# Altium schematic sheet 110_ESP32s3.SchDoc
size A4; SheetNumber: 12; SheetTotal: 12
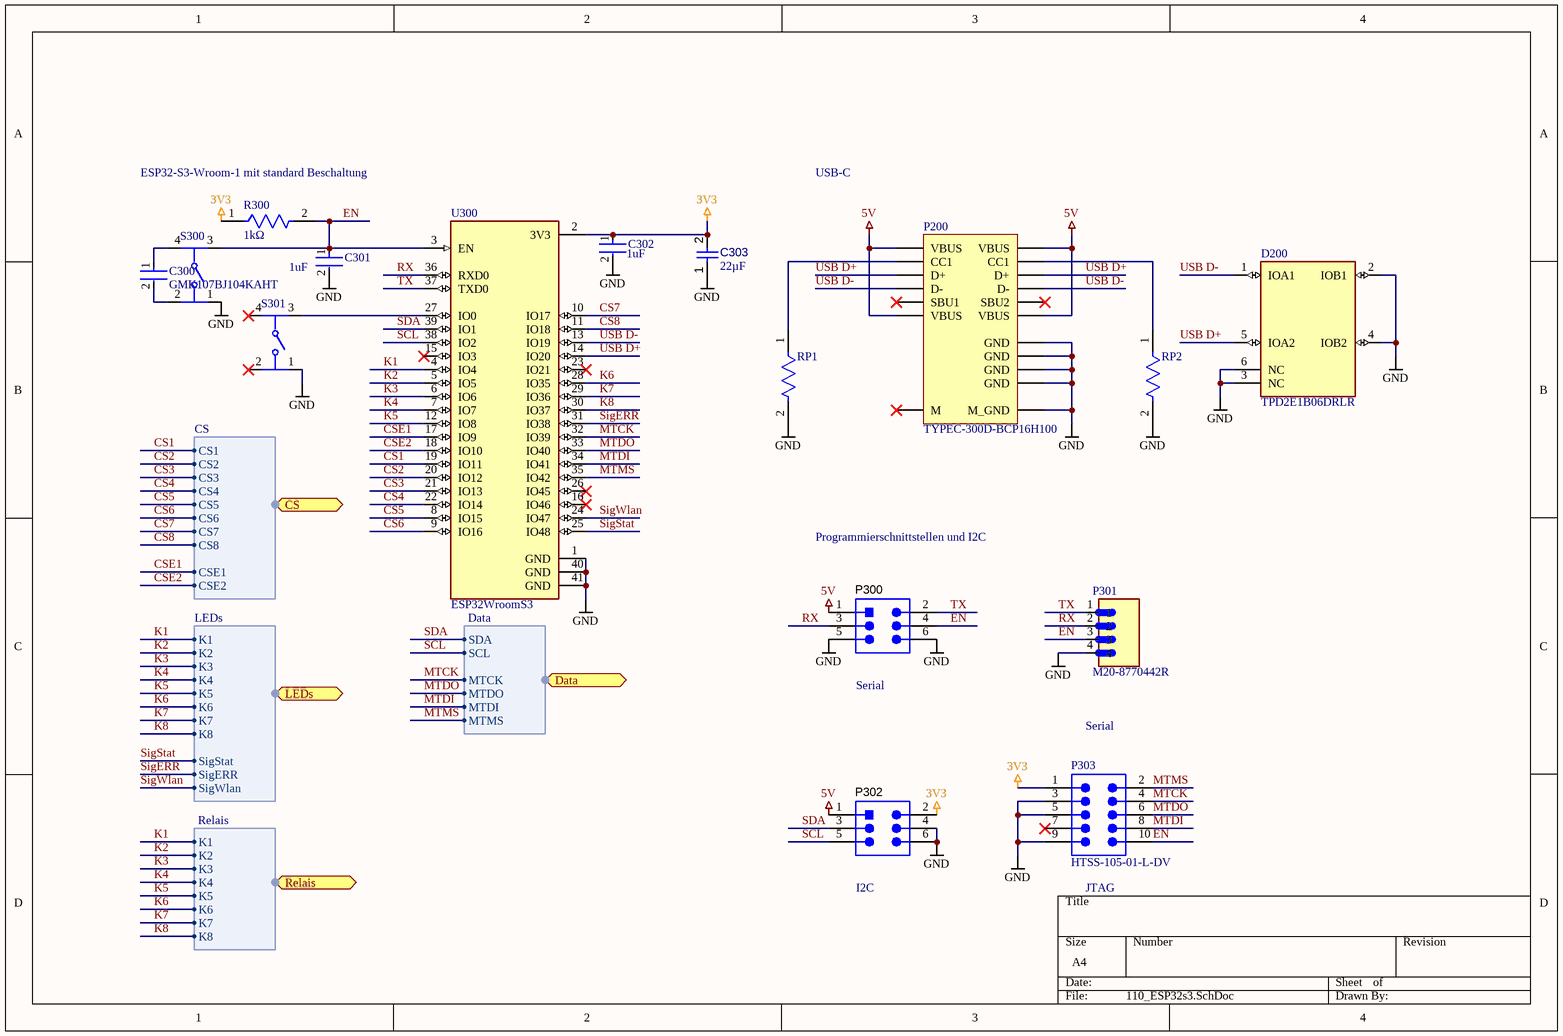
[diagram p0: 110_ESP32s3.SchDoc]

## Parts
C300  GMK107BJ104KAHT  [FP-0603-L_1_6_0_1-W_0_8_0-IPC_B]
C301  1uF  [FP-CGA3E-0_3-0_1-MFG]
C302  1uF  [FP-CGA3E-0_3-0_1-MFG]
C303  value 22µF  [CAPC0805(2012)145_L]  (hidden comment: Capacitor 22µF +/-40% 16V 0805)
D200  TPD2E1B06DRLR  [FP-DRL0006A-MFG]
P200  TYPEC-300D-BCP16H100  [TYPEC-300D-BCP16H100-Footprint-1]
P300  5-146130-2  [TECO-5-146130-2_V]  (value not drawn)
P301  M20-8770442R  [HARWIN_M20-8770442R]
P302  5-146130-2  [TECO-5-146130-2_V]  (value not drawn)
P303  HTSS-105-01-L-DV  [SMTC-HTSS-105-01-X-DV]
R300  1kΩ  [FP-CRCW0603-e3-MFG]
RP1  CRCW06035K10FKEA  [FP-CRCW0603-e3-IPC_C]  (value not drawn)
RP2  CRCW06035K10FKEA  [FP-CRCW0603-e3-IPC_C]  (value not drawn)
S300  (no value)  [FP-PTS645SM43SMTR92LFS-MFG]
S301  (no value)  [FP-PTS645SM43SMTR92LFS-MFG]
U300  ESP32WroomS3  [ESP32WroomS3]

## Ports
CS (bidir, harness CS), Data (bidir, harness Data), LEDs (bidir, harness LEDs), Relais (bidir, harness Relais)

## Harnesses
Relais: K1, K2, K3, K4, K5, K6, K7, K8
LEDs: K1, K2, K3, K4, K5, K6, K7, K8, SigStat, SigERR, SigWlan
CS: CS1, CS2, CS3, CS4, CS5, CS6, CS7, CS8, CSE1, CSE2
Data: SDA, SCL, MTCK, MTDO, MTDI, MTMS

## Nets
3V3: C302.1 C303.2 P302.2 P303.1 R300.1 U300.2(3V3)
5V: P200.A4(VBUS) P200.A9(VBUS) P200.B4(VBUS) P200.B9(VBUS) P300.1 P302.1
GND: C301.2 C302.2 C303.1 D200.2(IOB1) D200.3(NC) D200.4(IOB2) D200.6(NC) P200.A1(GND) P200.A12(GND) P200.B1(GND) P200.B12(GND) P200.M_GND P300.5 P300.6 P301.4 P302.4 P302.6 P303.3 P303.5 P303.9 RP1.2 RP2.2 S300.1 S301.1 U300.1(GND) U300.40(GND) U300.41(GND)
CS1: U300.19(IO11) ; port CS.CS1
CS2: U300.20(IO12) ; port CS.CS2
CS3: U300.21(IO13) ; port CS.CS3
CS4: U300.22(IO14) ; port CS.CS4
CS5: U300.8(IO15) ; port CS.CS5
CS6: U300.9(IO16) ; port CS.CS6
CS7: U300.10(IO17) ; port CS.CS7
CS8: U300.11(IO18) ; port CS.CS8
CSE1: U300.17(IO9) ; port CS.CSE1
CSE2: U300.18(IO10) ; port CS.CSE2
EN: C301.1 P300.4 P301.3 P303.10 R300.2 S300.3 U300.3(EN)
K1: U300.4(IO4) ; port Relais.K1, port LEDs.K1
K2: U300.5(IO5) ; port Relais.K2, port LEDs.K2
K3: U300.6(IO6) ; port Relais.K3, port LEDs.K3
K4: U300.7(IO7) ; port Relais.K4, port LEDs.K4
K5: U300.12(IO8) ; port Relais.K5, port LEDs.K5
K6: U300.28(IO35) ; port Relais.K6, port LEDs.K6
K7: U300.29(IO36) ; port Relais.K7, port LEDs.K7
K8: U300.30(IO37) ; port Relais.K8, port LEDs.K8
MTCK: P303.4 U300.32(IO39) ; port Data.MTCK
MTDI: P303.8 U300.34(IO41) ; port Data.MTDI
MTDO: P303.6 U300.33(IO40) ; port Data.MTDO
MTMS: P303.2 U300.35(IO42) ; port Data.MTMS
RX: P300.3 P301.2 U300.36(RXD0)
SCL: P302.5 U300.38(IO2) ; port Data.SCL
SDA: P302.3 U300.39(IO1) ; port Data.SDA
SigERR: U300.31(IO38) ; port LEDs.SigERR
SigStat: U300.25(IO48) ; port LEDs.SigStat
SigWlan: U300.24(IO47) ; port LEDs.SigWlan
TX: P300.2 P301.1 U300.37(TXD0)
USB D+: D200.5(IOA2) P200.A6(D+) P200.B6(D+) U300.14(IO20)
USB D-: D200.1(IOA1) P200.A7(D-) P200.B7(D-) U300.13(IO19)
NetC300_1: C300.1 S300.4
NetC300_2: C300.2 S300.2
NetP200_A5: P200.A5(CC1) RP1.1
NetP200_B5: P200.B5(CC1) RP2.1
NetS301_3: S301.3 U300.27(IO0)

Not connected (* = marked no-connect by the designer): P200 A8(SBU1)* B8(SBU2)* M*; P303 7*; S301 2* 4*; U300 15(IO3)* 16(IO46)* 23(IO21)* 26(IO45)*

## Notes on the sheet
- (near R300) ESP32-S3-Wroom-1 mit standard Beschaltung
- USB-C
- Programmierschnittstellen und I2C
- (near P300) Serial
- Serial
- (near P302) I2C
- (near P303) JTAG

## Library data of the parts
C300 = CMP-14477-002194-3: Ceramic Capacitor Automotive 0.1uF ±10% 35V X5R 0603; NexarPartId: 29103042; Capacitance: 100nF; Packaging: Digi-Reel®; Height: 900µm; Width: 800µm; Thickness: 889µm; Min Operating Temperature: -55°C; Termination: SMD/SMT; Mount: Surface Mount; Ratings: AEC-Q200; Halogen Free: Halogen Free; Tolerance: 10%; Max Operating Temperature: 85°C; Case Code (Metric): 1608; Case/Package: 0603; Lead Free: Lead Free; Case Code (Imperial): 0603; Length: 1.6002mm; Voltage Rating: 35V; Voltage Rating (DC): 35V; Dielectric: X5R; Min Width: 700µm; Min Length: 1.5mm; Max Length: 1.7mm; Material: Ceramic; Min Thickness: 700µm; Max Thickness: 900µm; RoHS: Compliant; Max Width: 900µm
C301 C302 = CMP-08246-002551-1: Cap Ceramic 1uF 35V X7R 10% Pad SMD 0603 +125°C Automotive T/R / CGA3E1X7R1V105K080AC; Termination: SMD/SMT; Packaging: Tape and Reel; Capacitance: 1uF; Tolerance: 10%; Mount: Surface Mount; Thickness: 0.035inch; Case Code (Imperial): 0603; Voltage Rating: 35V; Case/Package: 0603; Case Code (Metric): 1608; Dielectric: X7R; Width: 0.031inch; Length: 0.063inch; Min Operating Temperature: -55°C; Weight: 7.1E-05oz; Max Operating Temperature: 125°C; Voltage Rating (DC): 35V; Height: 0.8mm; Ratings: AEC-Q200; Package Quantity: 4000
C303 = CMP-001-00081-4: Chip Capacitor, 22µF +/-40%, 16V, 0805, Thickness 1.45 mm; Tolerance: 5%; Voltage Rating: 16V; Mounting Technology: SMT; Pins: 2; Max Operating Temperature: 85°C; Case/Package: 0805; Min Operating Temperature: -55°C
D200 = CMP-04985-000003-1: TVS DIODE 5.5V 15V 6SOT; Manufacturer: Texas Instruments; Peak Pulse Power: 35W; Peak Pulse Current: 2.5A; Direction: Bidirectional; Standoff Height: 0mm; Interface: I2C,USB,LVDS,Other; Number Of Channels: 2; Breakdown Voltage: 7V; Ambient Temperature Range High: +125°C; Package: DRL0006A; Automotive: No; Lead Free: Yes; Temperature Range Low: -40°C; Reverse Standoff Voltage: 5.5V; Clamping Voltage: 15V; Mouser Description: ESD Suppressors / TVS Diodes 2-CH system level ESD protect device; Temperature Range High: +125°C; Device Class L1: Circuit Protection; ComponentLink2Description: Datasheet; RoHS: TRUE; Ambient Temperature Range Low: -40°C; Height: 0.6mm; Device Class L3: unset; Device Class L2: ESD and Circuit Protection ICs; Temperature: -40°C to +125°C; Octopart: https://octopart.com/tpd2e1b06drlr-texas+instruments-30488860; ComponentLink2URL: http://www.ti.com/lit/ds/symlink/tpd2e1b06.pdf; Category: Diode; Manufacturer Part Number: TPD2E1B06DRLR; Digikey Description: TVS DIODE 5.5V 15V 6SOT
P200 = CMP-002-00081-3: Vertical USB Type C Connector
P300 P302 = CMP-1684-00011-1: Male Header, Pitch 2.54 mm, 2 x 3 Position, Height 8.13 mm, -65 to 125 degC, RoHS, Tube; Max Supply Voltage: 5.5 V; Min Supply Voltage: 4.5 V; Nominal Supply Voltage: 5 V; Min Operating Temperature: -40 degC; ComponentLink1URL: http://www.te.com/; ComponentLink2Description: Datasheet; Pins: 3; Max Operating Temperature: 150 degC; PackageDescription: Male Header, Pitch 2.54 mm, 2 x 3 Position, Height 8.13 mm; Package Quantity: 3000; PackageReference: 5-146130-2; DatasheetVersion: Oct-15; ComponentLink1Description: Manufacturer URL; Radiation Hardening: No; Mount: Surface Mount; RoHSCompliant: true; Packaging: Tape and Reel; ComponentLink2URL: http://www.te.com/commerce/DocumentDelivery/DDEController?Action=showdoc&DocId=Customer+Drawing%7F146130%7FM%7Fpdf%7FEnglish%7FENG_CD_146130_M.pdf%7F5-146130-2
P301 = M20-8770442R: Connector Header Surface Mount 4 position 0.100 (2.54mm); MF: Harwin Inc.; Package: None; Price: None; Check_prices: https://www.snapeda.com/parts/M20-8770442R/Harwin+Inc./view-part/?ref=eda; Value: *; SnapEDA_Link: https://www.snapeda.com/parts/M20-8770442R/Harwin+Inc./view-part/?ref=snap; MP: M20-8770442R; Availability: In Stock; Purchase-URL: https://pricing.snapeda.com/search?q=M20-8770442R&ref=eda
P303 = CMP-1024-00042-1: Shrouded .025" SQ Post Header, Surface Mount, Vertical, -55 to 125 degC, 2.54 mm Pitch, 10-Pin, Male, RoHS; Manufacturer: Samtec; Pitch: 2.54 mm; ComponentLink1URL: http://www.samtec.com; Mounting Technology: Surface Mount; ComponentLink3URL: http://www.samtec.com/documents/webfiles/cpdf/HTSS-1XX-01-XX-DV-X-XX-X-XX-MKT.pdf; ComponentLink2URL: http://www.samtec.com/documents/webfiles/pdf/htss.pdf; ComponentLink3Description: Package Specification; Orientation: Vertical; PackageDescription: High Temp Top Shroud; ComponentLink2Description: Datasheet; PackageVersion: Z, 7/2001; ComponentLink1Description: Manufacturer URL; Temperature Range: -55 to 125 degC; RoHS: True; PackageReference: HTSS-105-01-X-DV; DatasheetVersion: F-214; PartNumber: HTSS-105-01-L-DV
R300 = CMP-1666-00003-5: RES Thick Film, 1kΩ, 1%, 0.1W, 100ppm/°C, 0603, CRCW06031K00FKEA; Max Power Dissipation: 100mW; Voltage Rating: 75V; Resistance: 1kR; Max Operating Temperature: 155°C; Number of Pins: 2; Case Code (Imperial): 0603; Width: 0.033inch; Power Rating: 100mW; Number of Terminations: 2; Package Quantity: 10; Weight: 7.1E-05oz; Tolerance: 1%; Temperature Coefficient: 100ppm/°C; Military Standard: Not; Mount: Surface Mount; Voltage Rating (DC): 75V; Depth: 0.85mm; Composition: Thick Film; Radiation Hardening: No; Termination: SMD/SMT; Length: 1.55mm; Case Code (Metric): 1608; Contact Plating: Tin; Min Operating Temperature: -55°C; Packaging: Tape and Reel; Height: 0.45mm; Lead Free: Lead Free; Case/Package: 0603; Features: Automotive AEC-Q200
RP1 RP2 = CMP-1012-00590-3: RES Thick Film, 5.1kΩ, 1%, 0.1W, 100ppm/°C, 0603; Power Rating: 100mW; Voltage Rating (DC): 75V; Resistance: 5.1kR; Width: 0.85mm; Depth: 0.85mm; Military Standard: Not; Package Quantity: 5000; Case Code (Metric): 1608; Length: 1.55mm; Weight: 7.1E-05oz; Packaging: Tape and Reel; Temperature Coefficient: 100ppm/°C; Case Code (Imperial): 0603; Lead Free: Lead Free; Radiation Hardening: No; Contact Plating: Tin; Composition: Thick Film; Max Operating Temperature: 155°C; Termination: SMD/SMT; Case/Package: 0603; Min Operating Temperature: -55°C; Tolerance: 1%; Voltage Rating: 75V; Mount: Surface Mount; Height: 0.45mm
S300 S301 = CMP-2000-05160-2: SWITCH TACTILE SPST-NO 0.05A 12V / PTS645SM43SMTR92LFS; Contact Resistance: 100mR; Throw Configuration: SPST; Illumination Type: Non-Illuminated; Mechanical Life: 100000Cycles; Current Rating: 50mA; Switch Function: Off-Mom; Actuator Length: 0.85mm; Actuator Material: Nylon; Actuator Type: Standard; Operating Force: 160gf; Min Operating Temperature: -20°C; REACH SVHC: No SVHC; Termination: Gull Wing; Case/Package: SMD/SMT; Packaging: Tape and Reel; Mount: Surface Mount; Voltage Rating (DC): 12V; Orientation: Straight; Lead Free: Lead Free; Contact Material: Silver; Color: Black; Max Current Rating: 50mA; Contact Plating: Silver; Depth: 9mm; Package Quantity: 1; Max Voltage Rating (DC): 12V; Length: 6mm; Max Operating Temperature: 60°C
U300 = CMP-017-000002-1: Design Item ID: ESP32WroomS3; Source: Schaltdose.SchLib